# Altium schematic sheet ti_lab.SchDoc
size A3
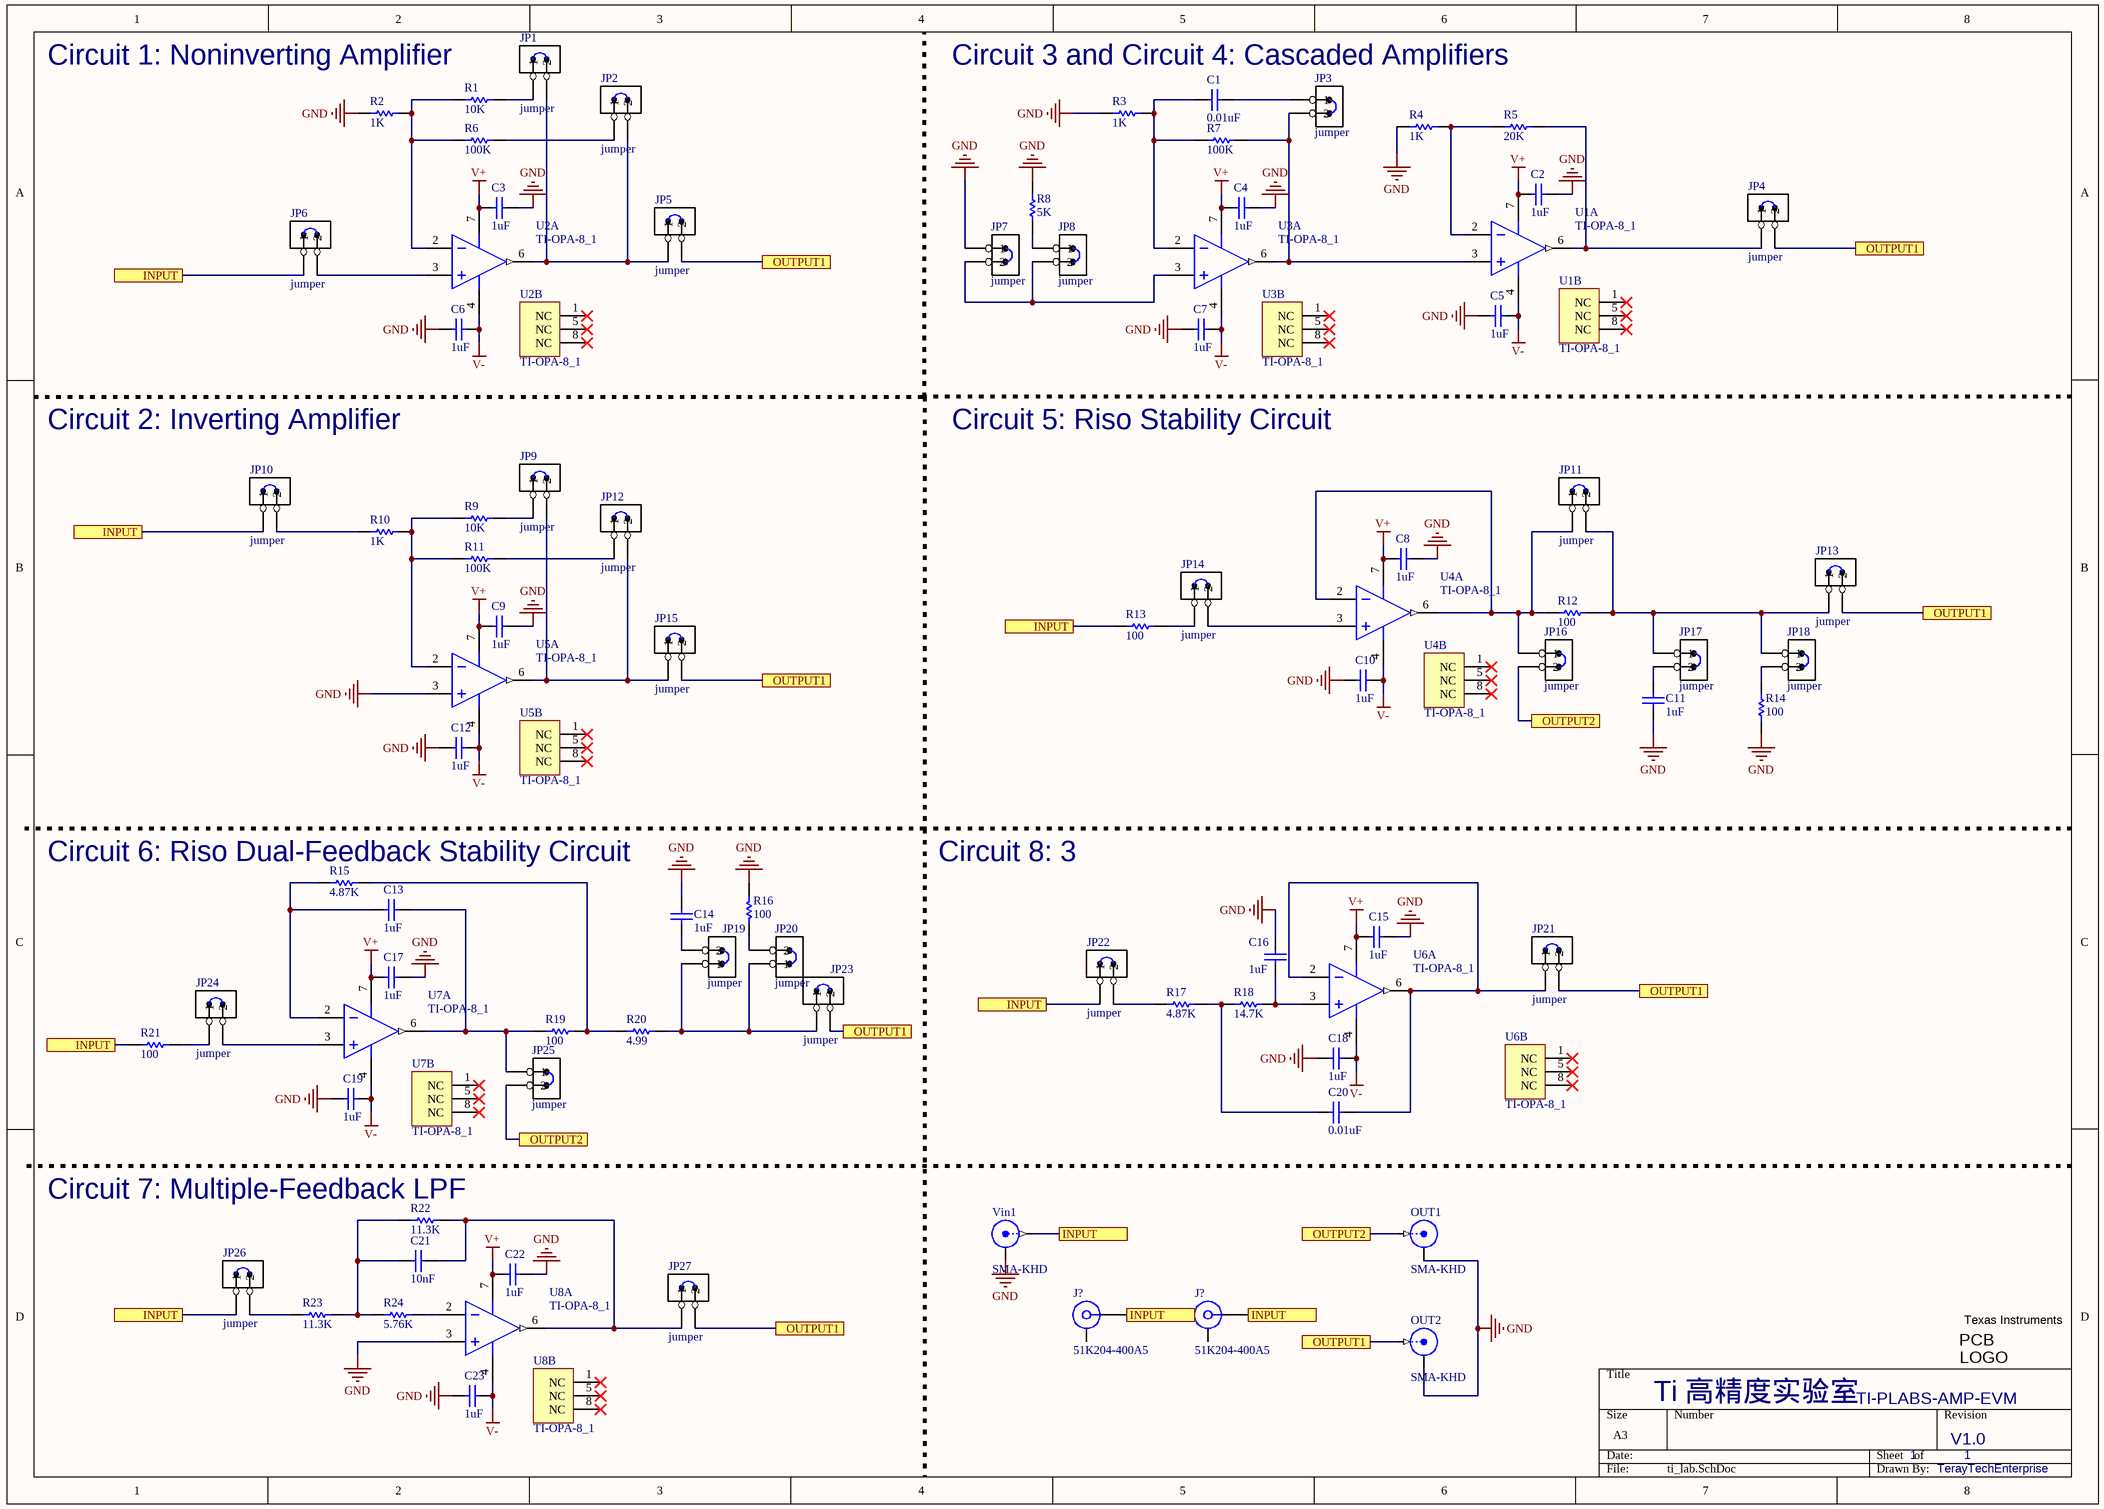
[diagram p0: ti_lab.SchDoc]

## Parts
(Parts that share a designator on the sheet are numbered #1, #2 ... from top to bottom, then left to right.)
C1  0.01uF  [0603_C]
C2  1uF  [0603_C]
C3  1uF  [0603_C]
C4  1uF  [0603_C]
C5  1uF  [0603_C]
C6  1uF  [0603_C]
C7  1uF  [0603_C]
C8  1uF  [0603_C]
C9  1uF  [0603_C]
C10  1uF  [0603_C]
C11  1uF  [0603_C]
C12  1uF  [0603_C]
C13  1uF  [0603_C]
C14  1uF  [0603_C]
C15  1uF  [0603_C]
C16  1uF  [0603_C]
C17  1uF  [0603_C]
C18  1uF  [0603_C]
C19  1uF  [0603_C]
C20  0.01uF  [0603_C]
C21  10nF  [0603_C]
C22  1uF  [0603_C]
C23  1uF  [0603_C]
J?#1  51K204-400A5  [ROS-51K204-400A5_V]
J?#2  51K204-400A5  [ROS-51K204-400A5_V]
JP1  jumper  [jumper]
JP2  jumper  [jumper]
JP3  jumper  [jumper]
JP4  jumper  [jumper]
JP5  jumper  [jumper]
JP6  jumper  [jumper]
JP7  jumper  [jumper]
JP8  jumper  [jumper]
JP9  jumper  [jumper]
JP10  jumper  [jumper]
JP11  jumper  [jumper]
JP12  jumper  [jumper]
JP13  jumper  [jumper]
JP14  jumper  [jumper]
JP15  jumper  [jumper]
JP16  jumper  [jumper]
JP17  jumper  [jumper]
JP18  jumper  [jumper]
JP19  jumper  [jumper]
JP20  jumper  [jumper]
JP21  jumper  [jumper]
JP22  jumper  [jumper]
JP23  jumper  [jumper]
JP24  jumper  [jumper]
JP25  jumper  [jumper]
JP26  jumper  [jumper]
JP27  jumper  [jumper]
Logo1  Texas Instruments  [TI_Stacked_Overlay_Small]  (no BOM)
OUT1  SMA-KHD  [SMA-2]
OUT2  SMA-KHD  [SMA-2]
R1  10K  [0603_R]
R2  1K  [0603_R]
R3  1K  [0603_R]
R4  1K  [0603_R]
R5  20K  [0603_R]
R6  100K  [0603_R]
R7  100K  [0603_R]
R8  5K  [0603_R]
R9  10K  [0603_R]
R10  1K  [0603_R]
R11  100K  [0603_R]
R12  100  [0603_R]
R13  100  [0603_R]
R14  100  [0603_R]
R15  4.87K  [0603_R]
R16  100  [0603_R]
R17  4.87K  [0603_R]
R18  14.7K  [0603_R]
R19  100  [0603_R]
R20  4.99  [0603_R]
R21  100  [0603_R]
R22  11.3K  [0603_R]
R23  11.3K  [0603_R]
R24  5.76K  [0603_R]
U1  TI-OPA-8_1  [DIP-8]  (parts A,B of 2)
U2  TI-OPA-8_1  [DIP-8]  (parts A,B of 2)
U3  TI-OPA-8_1  [DIP-8]  (parts A,B of 2)
U4  TI-OPA-8_1  [DIP-8]  (parts A,B of 2)
U5  TI-OPA-8_1  [DIP-8]  (parts A,B of 2)
U6  TI-OPA-8_1  [DIP-8]  (parts A,B of 2)
U7  TI-OPA-8_1  [DIP-8]  (parts A,B of 2)
U8  TI-OPA-8_1  [DIP-8]  (parts A,B of 2)
Vin1  SMA-KHD  [SMA-2]

## Ports
INPUT, OUTPUT1, OUTPUT2

## Nets
GND: C2.2 C3.2 C4.2 C5.1 C6.1 C7.1 C8.2 C9.2 C10.1 C11.1 C12.1 C14.1 C15.2 C16.2 C17.2 C18.1 C19.1 C22.2 C23.1 JP7.1 OUT1.1(Y) OUT2.1(Y) R2.1 R3.1 R4.1 R8.1 R14.1 R16.1 U5.3(IN+) U8.3(IN+) Vin1.1(Y)
V+: C2.1 C3.1 C4.1 C8.1 C9.1 C15.1 C17.1 C22.1 U1.7(V+) U2.7(V+) U3.7(V+) U4.7(V+) U5.7(V+) U6.7(V+) U7.7(V+) U8.7(V+)
V-: C5.2 C6.2 C7.2 C10.2 C12.2 C18.2 C19.2 C23.2 U1.4(V-) U2.4(V-) U3.4(V-) U4.4(V-) U5.4(V-) U6.4(V-) U7.4(V-) U8.4(V-)
INPUT: J?#1.1 J?#2.1 JP6.1 JP10.1 JP22.1 JP26.1 R13.1 R21.1 Vin1.2(X) ; port INPUT
OUTPUT1: JP4.2 JP5.2 JP13.2 JP15.2 JP21.2 JP23.2 JP27.2 OUT2.2(X) ; port OUTPUT1
OUTPUT2: JP16.2 JP25.2 OUT1.2(X) ; port OUTPUT2
NetC1_1: C1.1 R3.2 R7.1 U3.2(IN-)
NetC1_2: C1.2 JP3.1
NetC11_2: C11.2 JP17.2
NetC13_1: C13.1 R15.1 U7.2(IN-)
NetC13_2: C13.2 JP25.1 R19.1 U7.6(OUT)
NetC14_2: C14.2 JP19.2
NetC16_1: C16.1 R18.2 U6.3(IN+)
NetC20_1: C20.1 R17.2 R18.1
NetC20_2: C20.2 JP21.1 U6.2(IN-) U6.6(OUT)
NetC21_1: C21.1 R22.1 R23.2 R24.1
NetC21_2: C21.2 JP27.1 R22.2 U8.6(OUT)
NetJP1_1: JP1.1 R1.2
NetJP1_2: JP1.2 JP2.2 JP5.1 U2.6(OUT)
NetJP2_1: JP2.1 R6.2
NetJP3_2: JP3.2 R7.2 U1.3(IN+) U3.6(OUT)
NetJP4_1: JP4.1 R5.2 U1.6(OUT)
NetJP6_2: JP6.2 U2.3(IN+)
NetJP7_2: JP7.2 JP8.2 U3.3(IN+)
NetJP8_1: JP8.1 R8.2
NetJP9_1: JP9.1 R9.2
NetJP9_2: JP9.2 JP12.2 JP15.1 U5.6(OUT)
NetJP10_2: JP10.2 R10.1
NetJP11_1: JP11.1 JP16.1 R12.1 U4.2(IN-) U4.6(OUT)
NetJP11_2: JP11.2 JP13.1 JP17.1 JP18.1 R12.2
NetJP12_1: JP12.1 R11.2
NetJP14_1: JP14.1 R13.2
NetJP14_2: JP14.2 U4.3(IN+)
NetJP18_2: JP18.2 R14.2
NetJP19_1: JP19.1 JP20.1 JP23.1 R20.1
NetJP20_2: JP20.2 R16.2
NetJP22_2: JP22.2 R17.1
NetJP24_1: JP24.1 R21.2
NetJP24_2: JP24.2 U7.3(IN+)
NetJP26_2: JP26.2 R23.1
NetR1_1: R1.1 R2.2 R6.1 U2.2(IN-)
NetR4_2: R4.2 R5.1 U1.2(IN-)
NetR9_1: R9.1 R10.2 R11.1 U5.2(IN-)
NetR15_2: R15.2 R19.2 R20.2
NetR24_2: R24.2 U8.2(IN-)

Not connected (* = marked no-connect by the designer): J?#1 MH; J?#2 MH; U1 1(NC)* 5(NC)* 8(NC)*; U2 1(NC)* 5(NC)* 8(NC)*; U3 1(NC)* 5(NC)* 8(NC)*; U4 1(NC)* 5(NC)* 8(NC)*; U5 1(NC)* 5(NC)* 8(NC)*; U6 1(NC)* 5(NC)* 8(NC)*; U7 1(NC)* 5(NC)* 8(NC)*; U8 1(NC)* 5(NC)* 8(NC)*

## Notes on the sheet
- (near JP1) Circuit 1: Noninverting Amplifier
- Circuit 3 and Circuit 4: Cascaded Amplifiers
- Circuit 2: Inverting Amplifier
- Circuit 5: Riso Stability Circuit
- (near R15) Circuit 6: Riso Dual-Feedback Stability Circuit
- Circuit 8: 3
- (near R22) Circuit 7: Multiple-Feedback LPF
- Ti 高精度实验室
- (near Logo1) TI-PLABS-AMP-EVM
- 1
- V1.0
- TerayTechEnterprise
- (in symbol TI_Logo) PCB; LOGO

## Library data of the parts
C1-C23 = CAP: Capacitor; Value: 104; Published: 8-Jun-2000; LatestRevisionDate: 17-Jul-2002; LatestRevisionNote: Re-released for DXP Platform.; PackageReference: RAD-0.3; Publisher: Altium Limited
J?#1 J?#2 = CMP-0753-00004-1: BNC 50R Right Angle Jack, Panel Feedthrough, Up to 10 GHz, -55 to 155 degC; Manufacturer: Rosenberger; Design Note: Footprint in library is a generic example - only application specific footprint delivers High Performance; PartNumber: 51K204-400A5; PackageReference: 51K204-400A5; DatasheetVersion: d00; ComponentLink2Description: Datasheet; ComponentLink5Description: Webshop / RFQ; ComponentLink1URL: http://www.rosenberger.de; ComponentLink4URL: http://rosenberger.de/ok/images/documents/spez/51.pdf; PackageVersion: d00; ComponentLink5URL: http://www.rosenberger.com/en/contact/sales/; ComponentLink3URL: http://rosenberger.de/ok/images/documents/db/51K204-400A5.pdf; ComponentLink2URL: http://rosenberger.de/ok/images/documents/db/51K204-400A5.pdf; ComponentLink1Description: Manufacturer URL; Mounting Technology: Through Hole; PackageDescription: 50R BNC Right Angle Jack, 12.5 x 32.6 x 14.5 mm; ComponentLink4Description: Series Overview / Design Note; ComponentLink3Description: Package Specification
JP1-JP27 = jumper: t跳线帽
Logo1 = TI_Logo: Texas Instrument Corporate Signature; SymbolCreator: codlsc; SymbolVersion: 2011-08-22; Published: 2009-03-03; Publisher: National Semiconductor; ClassName: Logo; LatestRevisionDate: 2011-10-25; LatestRevisionNote: Added ClassName of Logo.
OUT1 OUT2 Vin1 = SMA_KHD
R1 R5-R9 R11-R24 = RES: Resistor; Value: 1K; Published: 8-Jun-2000; Revision: July-2002: Re-released for DXP Platform.; Publisher: Altium Limited
R2-R4 R10 = RES: Resistor; Published: 8-Jun-2000; Revision: July-2002: Re-released for DXP Platform.; Publisher: Altium Limited; Value: 1K